# Altium schematic sheet gyro_board.SchDoc
size A
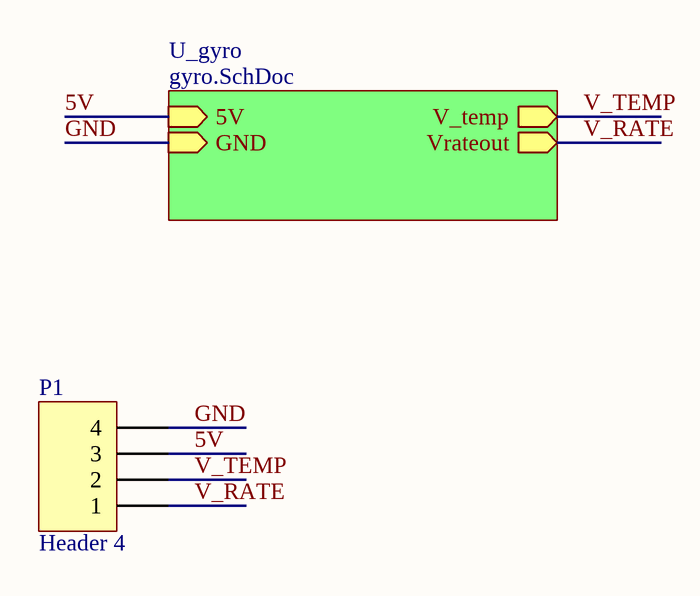
[diagram p0: gyro_board.SchDoc]

## Parts
P1  Header 4  [gyro_connect]

## Sub-sheets
U_gyro = gyro.SchDoc: V_temp (out), Vrateout (out), 5V (in), GND (in)

## Nets
5V: P1.3 ; sheet U_gyro/5V
GND: P1.4 ; sheet U_gyro/GND
V_RATE: P1.1 ; sheet U_gyro/Vrateout
V_TEMP: P1.2 ; sheet U_gyro/V_temp

## Library data of the parts
P1 = Header 4: Header, 4-Pin; LatestRevisionDate: 17-Jul-2002; LatestRevisionNote: Re-released for DXP Platform.; Publisher: Altium Limited